# Altium schematic sheet LCD.SchDoc
size A4; DocumentNumber: 2; SheetNumber: 2; SheetTotal: 5
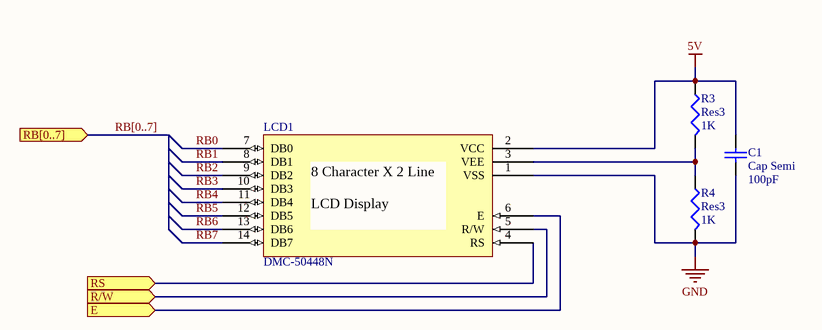
[diagram p0: LCD.SchDoc]

## Parts
C1  Cap Semi  value 100pF  [0603_C]
LCD1  DMC-50448N  [HDR1X14]
R3  Res3  value 1K  [0603_R]
R4  Res3  value 1K  [0603_R]

## Ports
E (in), R/W (in), RB[0..7] (in), RS (in)

## Nets
5V: C1.2 LCD1.2(VCC) R3.1
GND: C1.1 LCD1.1(VSS) R4.2
E: LCD1.6(E) ; port E
R/W: LCD1.5(R/W) ; port R/W
RB0: LCD1.7(DB0)
RB1: LCD1.8(DB1)
RB2: LCD1.9(DB2)
RB3: LCD1.10(DB3)
RB4: LCD1.11(DB4)
RB5: LCD1.12(DB5)
RB6: LCD1.13(DB6)
RB7: LCD1.14(DB7)
RS: LCD1.4(RS) ; port RS
NetLCD1_3: LCD1.3(VEE) R3.2 R4.1

## Buses and harness runs
bus RB[0..7] = port RB[0..7]

## Notes on the sheet
- (in symbol DMC-50448N) 8 Character X 2 Line / LCD Display

## Library data of the parts
C1 = Cap Semi: Capacitor (Semiconductor SIM Model); Published: 8-Jun-2000; LatestRevisionDate: 29-May-2009; LatestRevisionNote: IPC-7351 Footprint Added.; PackageReference: C1206; Publisher: Altium Limited; PackageDescription: Chip Capacitor
LCD1 = DMC-50448N: 8 Character X 2 Line / LCD Display
R3 R4 = Res3: Resistor; Published: 8-Jun-2000; LatestRevisionDate: 29-May-2009; LatestRevisionNote: IPC-7351 Footprint Added.; PackageReference: J1-0603; Publisher: Altium Limited; PackageDescription: Chip Resistor